# Altium schematic sheet 1_fakewire.schdoc
size 307 x 218 mm; Symbol: Drawing-Symbol_A4; Device: Drawing-Symbol_A4; @Project Name: PowerManagement Board for Rpi; @Page Count: 1; @Update Date: 2025-01-31; @Create Date: 2025-01-29; @Schematic Name: type-c fake wire; @Page No: 1; @Page Name: fakewire; Company: EasyEDA.com; Version: V1.0; Page Size: A4; @Create Time: 22:53:17; @Update Time: 10:23:57; Width: 1170; Height: 825; Region Start: 1; X Region Count: 6; Y Region Count: 4; Blade Width: 10; Title Block Position: 3; @Board Name: Board3
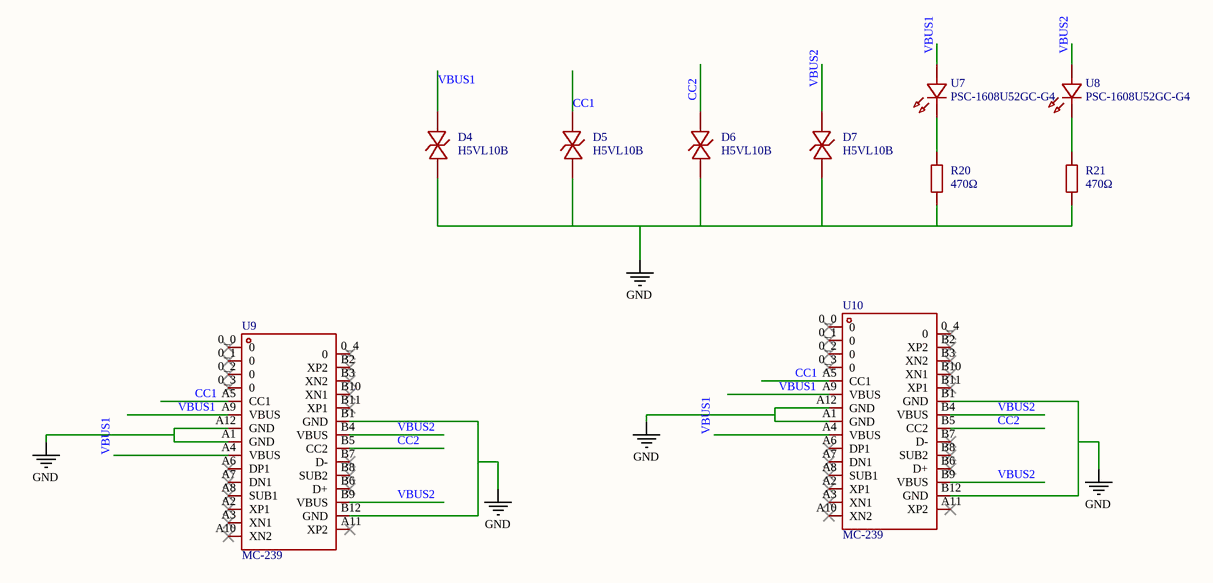
[diagram p0: 1_fakewire.schdoc]

## Parts
D4  H5VL10B  [SOD-882_L1.0-W0.6-BI]
D5  H5VL10B  [SOD-882_L1.0-W0.6-BI]
D6  H5VL10B  [SOD-882_L1.0-W0.6-BI]
D7  H5VL10B  [SOD-882_L1.0-W0.6-BI]
R20  470Ω  [R0603]
R21  470Ω  [R0603]
U7  PSC-1608U52GC-G4  [LED0603-RD_GREEN]
U8  PSC-1608U52GC-G4  [LED0603-RD_GREEN]
U9  MC-239  [CONN-TH_MC-239]
U10  MC-239  [CONN-TH_MC-239]

## Nets
GND: D4.1(C) D5.1(C) D6.1(C) D7.1(C) R20.1 R21.1 U9.A1(GND) U9.A12(GND) U9.B1(GND) U9.B12(GND) U10.A1(GND) U10.A12(GND) U10.B1(GND) U10.B12(GND)
CC1: D5.2(A) U9.A5(CC1) U10.A5(CC1)
CC2: D6.2(A) U9.B5(CC2) U10.B5(CC2)
VBUS1: D4.2(A) U7.2(A) U9.A4(VBUS) U9.A9(VBUS) U10.A4(VBUS) U10.A9(VBUS)
VBUS2: D7.2(A) U8.2(A) U9.B4(VBUS) U9.B9(VBUS) U10.B4(VBUS) U10.B9(VBUS)
NetR20_2: R20.2 U7.1(K)
NetR21_2: R21.2 U8.1(K)

Not connected (* = marked no-connect by the designer): U9 0_0(0)* 0_1(0)* 0_2(0)* 0_3(0)* 0_4(0)* A2(XP1)* A3(XN1)* A6(DP1)* A7(DN1)* A8(SUB1)* A10(XN2)* A11(XP2)* B2(XP2)* B3(XN2)* B6(D+)* B7(D-)* B8(SUB2)* B10(XN1)* B11(XP1)*; U10 0_0(0)* 0_1(0)* 0_2(0)* 0_3(0)* 0_4(0)* A2(XP1)* A3(XN1)* A6(DP1)* A7(DN1)* A8(SUB1)* A10(XN2)* A11(XP2)* B2(XP2)* B3(XN2)* B6(D+)* B7(D-)* B8(SUB2)* B10(XN1)* B11(XP1)*

## Notes on the sheet
- 1
- 2
- 3
- 4
- 5
- 6
- A
- B
- C
- Schematic
- type-c fake wire
- Create at
- Update at
- 2025-01-29
- 2025-01-31
- Board
- Drawn
- Board3
- Page
- fakewire
- D
- Reviewed
- Version
- Size
- PowerManagement Board for Rpi
- Page  1  Total  1
- V1.0
- A4
- EasyEDA.com

## Library data of the parts
D4-D7 = H5VL10B: Manufacturer: 宏迦橙; Add into BOM: yes; polarity: Bidirectional; Reverse Stand-Off Voltage (Vrwm): 5V; Maximum Clamping Voltage: 10V; Peak Pulse Current (Ipp): 5A; Peak Pulse Power Dissipation (Ppp): 50W; Breakdown Voltage: 5.6V; Reverse Leakage Current (Ir): 100nA; Number of Lines: Single channel; Type: ESD; Symbol: H5VL10B; Device: H5VL10B; LCSC Part Name: H5VL10B 丝印 PB; Supplier Part: C7420372; Manufacturer Part: H5VL10B; Supplier Footprint: DFN1006-2L; JLCPCB Part Class: Extended Part; Datasheet: https://atta.szlcsc.com/upload/public/pdf/source/20230630/5024ECFEAD3C9801B07A8DBB967AB462.pdf; Supplier: LCSC; Convert to PCB: yes; Operating Temperature: -55℃~+155℃; level of protection: -; Junction Capacitance: -
R20 R21 = RC0603FR-07470RL: Manufacturer: YAGEO(国巨); Add into BOM: yes; Tolerance: ±1%; Temperature Coefficient: ±100ppm/℃; Symbol: RC0603FR-07470RL; Device: RC0603FR-07470RL; LCSC Part Name: 厚膜电阻 470Ω ±1% 100mW; Supplier Part: C114669; Manufacturer Part: RC0603FR-07470RL; Supplier Footprint: 0603; JLCPCB Part Class: Extended Part; Datasheet: https://atta.szlcsc.com/upload/public/pdf/source/20180821/C275644_0D56F95EFF785E7D9A1FEF436B37DA78.pdf; Supplier: LCSC; Convert to PCB: yes; Type: Thick Film Resistors; Value: 470Ω; Operating Temperature Range: -55℃~+155℃
U7 U8 = PSC-1608U52GC-G4: Manufacturer: HONGLITRONIC(鸿利光电); Add into BOM: yes; Emitted Color: Green; Symbol: PSC-1608U52GC-G4; Device: PSC-1608U52GC-G4; LCSC Part Name: 钻孔1608低亮绿灯; Supplier Part: C22371297; Manufacturer Part: PSC-1608U52GC-G4; Supplier Footprint: 0603; JLCPCB Part Class: Extended Part; Datasheet: https://atta.szlcsc.com/upload/public/pdf/source/20240328/4E4686E4F5DB651C0553C7ABD92F986B.pdf; Supplier: LCSC; Convert to PCB: yes
U9 U10 = MC-239: Manufacturer: HANBO(汉博); Add into BOM: yes; Connector Type: Type-C; Gender: Male; Number of Contacts: 24P; Number of Ports: 1; Current Rating - Power (Max): 5A; Symbol: MC-239; Device: MC-239; LCSC Part Name: Type-C 公 直插; Supplier Part: C3039321; Manufacturer Part: MC-239; Supplier Footprint: SMD; JLCPCB Part Class: Extended Part; Datasheet: https://atta.szlcsc.com/upload/public/pdf/source/20221111/A7BD9F5355A90436A15C5EFA97F312BA.pdf; Supplier: LCSC; Convert to PCB: yes; Standard: USB 3.1; Mounting Style: Direct Insert; Contact Material: -; Contact Plating: -; Operating Temperature Range: -25℃~+85℃; Soldering Temperature(Max): -